# EAGLE design a2600 (EAGLE 7.4.0)
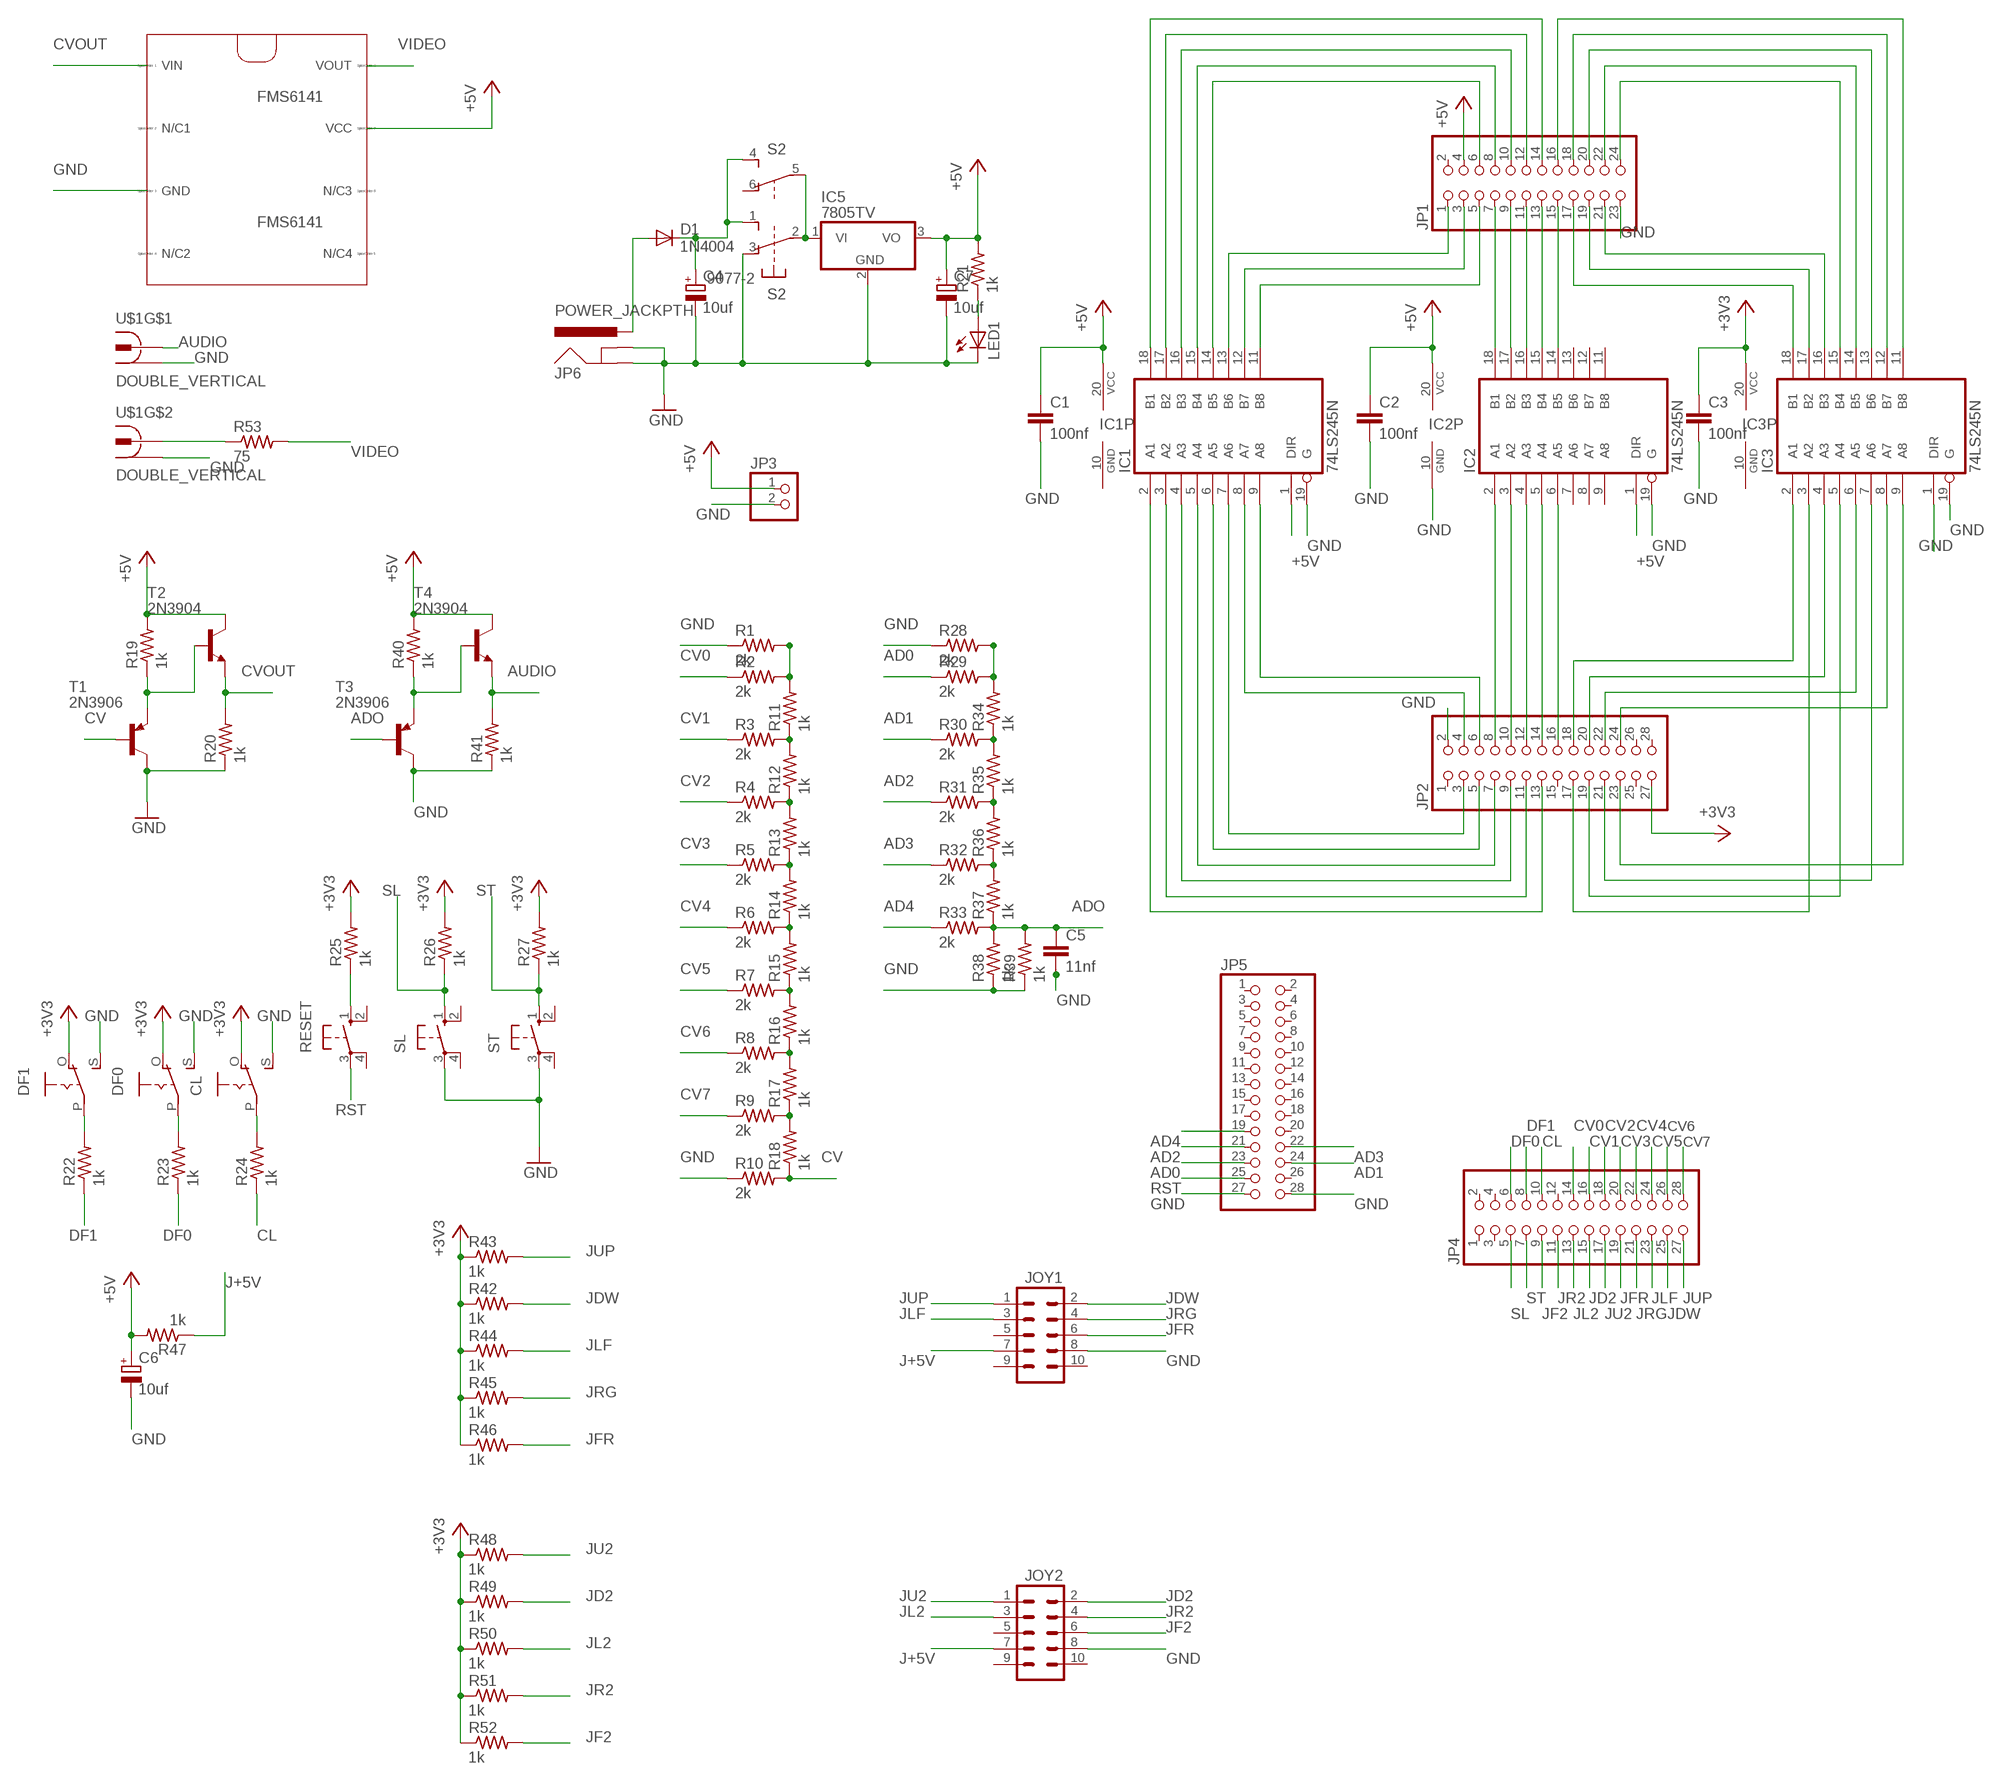
[diagram p0: schematic, sheet 1]

## Parts
C1  100nf  C5/2.5  [C5B2.5]
C2  100nf  C5/2.5  [C5B2.5]
C3  100nf  C5/2.5  [C5B2.5]
C4  10uf  CPOL-EUE2.5-6  [E2,5-6]
C5  11nf  C5/2.5  [C5B2.5]
C6  10uf  CPOL-EUTT2D5L  [TT2D5L]
C7  10uf  CPOL-EUE2.5-6  [E2,5-6]
CL  EG1218S  [EG1218]
D1  1N4004  [DO41-10]
DF0  EG1218S  [EG1218]
DF1  EG1218S  [EG1218]
IC1  74LS245N  [DIL20]
IC2  74LS245N  [DIL20]
IC3  74LS245N  [DIL20]
IC5  7805TV  [TO220V]
JOY1  M05X2SHD_LOCK  [2X5-SHROUDED_LOCK]
JOY2  M05X2SHD_LOCK  [2X5-SHROUDED_LOCK]
JP1  ATARI2600_SLOT  [ATARI2600_SLOT]
JP2  PINHD-2X14  [2X14]
JP3  PINHD-1X2/90  [1X02/90]
JP4  PINHD-2X14  [2X14]
JP5  PINHD-2X14  [2X14]
JP6  POWER_JACKPTH  [POWER_JACK_PTH]
LED1  LED3MM  [LED3MM]
R1  2k  R-US_0309/V  [0309V]
R2  2k  R-US_0309/V  [0309V]
R3  2k  R-US_0309/V  [0309V]
R4  2k  R-US_0309/V  [0309V]
R5  2k  R-US_0309/V  [0309V]
R6  2k  R-US_0309/V  [0309V]
R7  2k  R-US_0309/V  [0309V]
R8  2k  R-US_0309/V  [0309V]
R9  2k  R-US_0309/V  [0309V]
R10  2k  R-US_0309/V  [0309V]
R11  1k  R-US_0309/V  [0309V]
R12  1k  R-US_0309/V  [0309V]
R13  1k  R-US_0309/V  [0309V]
R14  1k  R-US_0309/V  [0309V]
R15  1k  R-US_0309/V  [0309V]
R16  1k  R-US_0309/V  [0309V]
R17  1k  R-US_0309/V  [0309V]
R18  1k  R-US_0309/V  [0309V]
R19  1k  R-US_0309/V  [0309V]
R20  1k  R-US_0309/V  [0309V]
R21  1k  R-US_0309/V  [0309V]
R22  1k  R-US_0309/V  [0309V]
R23  1k  R-US_0309/V  [0309V]
R24  1k  R-US_0309/V  [0309V]
R25  1k  R-US_0309/V  [0309V]
R26  1k  R-US_0309/V  [0309V]
R27  1k  R-US_0309/V  [0309V]
R28  2k  R-US_0309/V  [0309V]
R29  2k  R-US_0309/V  [0309V]
R30  2k  R-US_0309/V  [0309V]
R31  2k  R-US_0309/V  [0309V]
R32  2k  R-US_0309/V  [0309V]
R33  2k  R-US_0309/V  [0309V]
R34  1k  R-US_0309/V  [0309V]
R35  1k  R-US_0309/V  [0309V]
R36  1k  R-US_0309/V  [0309V]
R37  1k  R-US_0309/V  [0309V]
R38  1k  R-US_0309/V  [0309V]
R39  1k  R-US_0309/V  [0309V]
R40  1k  R-US_0309/V  [0309V]
R41  1k  R-US_0309/V  [0309V]
R42  1k  R-US_0309/12  [0309/12]
R43  1k  R-US_0309/12  [0309/12]
R44  1k  R-US_0309/12  [0309/12]
R45  1k  R-US_0309/12  [0309/12]
R46  1k  R-US_0309/12  [0309/12]
R47  1k  R-US_0309/12  [0309/12]
R48  1k  R-US_0309/12  [0309/12]
R49  1k  R-US_0309/12  [0309/12]
R50  1k  R-US_0309/12  [0309/12]
R51  1k  R-US_0309/12  [0309/12]
R52  1k  R-US_0309/12  [0309/12]
R53  75  R-US_0309/V  [0309V]
RESET  10-XX  [B3F-10XX]
S2  9077-2  [9077-2]
SL  10-XX  [B3F-10XX]
ST  10-XX  [B3F-10XX]
T1  2N3906  2N3906-PNP-TO92-EBC  [TO92-EBC]
T2  2N3904  2N3904-NPN-TO92-EBC  [TO92-EBC]
T3  2N3906  2N3906-PNP-TO92-EBC  [TO92-EBC]
T4  2N3904  2N3904-NPN-TO92-EBC  [TO92-EBC]
U$1  DOUBLE_VERTICAL  [DOUBLE-VERTICAL]
X1  FMS6141  [SOIC8]

## Nets
+3V3: C3.1 CL.O DF0.O DF1.O IC3.20(VCC) JP2.27 R25.2 R26.2 R27.2 R42.1 R43.1 R44.1 R45.1 R46.1 R48.1 R49.1 R50.1 R51.1 R52.1
+5V: C1.1 C2.1 C6.+ C7.+ IC1.1(DIR) IC1.20(VCC) IC2.1(DIR) IC2.20(VCC) IC5.3(VO) JP1.4 JP3.1 R19.2 R21.2 R40.2 R47.2 T2.C T4.C X1.6(VCC)
AD0: JP5.23 R29.1
AD1: JP5.24 R30.1
AD2: JP5.21 R31.1
AD3: JP5.22 R32.1
AD4: JP5.19 R33.1
ADO: C5.1 R33.2 R37.1 R38.2 R39.2 T3.B
AUDIO: R41.2 T4.E U$1.HS
CL: JP4.10 R24.1
CV: R10.2 R18.1 T1.B
CV0: JP4.14 R2.1
CV1: JP4.16 R3.1
CV2: JP4.18 R4.1
CV3: JP4.20 R5.1
CV4: JP4.22 R6.1
CV5: JP4.24 R7.1
CV6: JP4.26 R8.1
CV7: JP4.28 R9.1
CVOUT: R20.2 T2.E X1.1(VIN)
DF0: JP4.6 R23.1
DF1: JP4.8 R22.1
GND: C1.2 C2.2 C3.2 C4.- C5.2 C6.- C7.- CL.S DF0.S DF1.S IC1.19(G) IC2.10(GND) IC2.19(G) IC3.1(DIR) IC3.19(G) IC5.2(GND) JOY1.8 JOY2.8 JP1.23 JP2.2 JP3.2 JP5.27 JP5.28 JP6.GND JP6.GNDBREAK LED1.K(C) R1.1 R10.1 R20.1 R28.1 R38.1 R39.1 R41.1 S2.3(1:O) SL.3(P) ST.3(P) T1.C T3.C U$1.HG U$1.LG X1.3(GND)
J+5V: JOY1.7 JOY2.7 R47.1
JD2: JOY2.2 JP4.15 R49.2
JDW: JOY1.2 JP4.25 R42.2
JF2: JOY2.6 JP4.9 R52.2
JFR: JOY1.6 JP4.19 R46.2
JL2: JOY2.3 JP4.13 R50.2
JLF: JOY1.3 JP4.23 R44.2
JR2: JOY2.4 JP4.11 R51.2
JRG: JOY1.4 JP4.21 R45.2
JU2: JOY2.1 JP4.17 R48.2
JUP: JOY1.1 JP4.27 R43.2
N$1: IC1.18(B1) JP1.14
N$2: IC1.17(B2) JP1.12
N$3: IC1.16(B3) JP1.10
N$4: IC1.15(B4) JP1.8
N$5: IC1.14(B5) JP1.6
N$6: IC1.13(B6) JP1.1
N$7: IC1.12(B7) JP1.3
N$8: IC1.11(B8) JP1.5
N$9: IC2.18(B1) JP1.7
N$10: IC2.17(B2) JP1.9
N$11: IC2.16(B3) JP1.11
N$12: IC2.15(B4) JP1.13
N$13: IC2.14(B5) JP1.15
N$14: IC3.18(B1) JP1.17
N$15: IC3.17(B2) JP1.19
N$16: IC3.16(B3) JP1.21
N$17: IC3.15(B4) JP1.24
N$18: IC3.14(B5) JP1.22
N$19: IC3.13(B6) JP1.20
N$20: IC3.12(B7) JP1.18
N$21: IC3.11(B8) JP1.16
N$22: IC1.2(A1) JP2.13
N$23: IC1.3(A2) JP2.11
N$24: IC1.4(A3) JP2.9
N$25: IC1.5(A4) JP2.7
N$26: IC1.6(A5) JP2.5
N$27: IC1.7(A6) JP2.3
N$28: IC1.8(A7) JP2.4
N$29: IC1.9(A8) JP2.6
N$30: IC2.2(A1) JP2.8
N$31: IC2.3(A2) JP2.10
N$32: IC2.4(A3) JP2.12
N$33: IC2.5(A4) JP2.14
N$34: IC2.6(A5) JP2.16
N$35: IC3.2(A1) JP2.18
N$36: IC3.3(A2) JP2.17
N$37: IC3.4(A3) JP2.20
N$38: IC3.5(A4) JP2.19
N$39: IC3.6(A5) JP2.22
N$40: IC3.7(A6) JP2.21
N$41: IC3.8(A7) JP2.24
N$42: IC3.9(A8) JP2.23
N$43: D1.A JP6.PWR
N$44: IC5.1(VI) S2.2(1:P) S2.5(2:P)
N$45: R1.2 R2.2 R11.2
N$46: R3.2 R11.1 R12.2
N$47: R53.1 U$1.LS
N$49: C4.+ D1.C S2.1(1:S) S2.4(2:S)
N$50: R4.2 R12.1 R13.2
N$51: R5.2 R13.1 R14.2
N$52: R6.2 R14.1 R15.2
N$53: R7.2 R15.1 R16.2
N$54: R8.2 R16.1 R17.2
N$55: R9.2 R17.1 R18.2
N$57: R19.1 T1.E T2.B
N$58: LED1.A R21.1
N$59: DF1.P R22.2
N$60: DF0.P R23.2
N$61: CL.P R24.2
N$62: R28.2 R29.2 R34.2
N$63: R30.2 R34.1 R35.2
N$64: R31.2 R35.1 R36.2
N$65: R32.2 R36.1 R37.2
N$66: R25.1 RESET.1(S)
N$67: R40.1 T3.E T4.B
RST: JP5.25 RESET.3(P)
SL: JP4.5 R26.1 SL.1(S)
ST: JP4.7 R27.1 ST.1(S)
VIDEO: R53.2 X1.5(VOUT)
Unconnected: IC2.7(A6) IC2.8(A7) IC2.9(A8) IC2.11(B8) IC2.12(B7) IC2.13(B6) JOY1.5 JOY1.9 JOY1.10 JOY2.5 JOY2.9 JOY2.10 JP1.2 JP2.1 JP2.15 JP2.25 JP2.26 JP2.28 JP4.1 JP4.2 JP4.3 JP4.4 JP4.12 JP5.1 JP5.2 JP5.3 JP5.4 JP5.5 JP5.6 JP5.7 JP5.8 JP5.9 JP5.10 JP5.11 JP5.12 JP5.13 JP5.14 JP5.15 JP5.16 JP5.17 JP5.18 JP5.20 JP5.26 RESET.2(S1) RESET.4(P1) S2.6(2:O) SL.2(S1) SL.4(P1) ST.2(S1) ST.4(P1) X1.2(N/C1) X1.4(N/C2) X1.7(N/C3) X1.8(N/C4)

## Power pins joined to a net without a drawn wire
GND: IC1.10(GND) IC3.10(GND)

## Library data of the parts
C1-C3 C5 = capacitor-wima:C: CAPACITOR naming: grid - package width
C4 C6 C7 = resistor:CPOL-EU: POLARIZED CAPACITOR, European symbol
CL DF0 DF1 = adafruit:EG1218: SLIDING SWITCH 0.1" spacing through hole, vertical SPDT slide switch http://www.ladyada.net/library/pcb/eaglelibrary.html
D1 = adafruit:1N4004: DIODE General purpose 1N400x type rectifier (With bigger pads) http://www.ladyada.net/library/pcb/eaglelibrary.html
IC1-IC3 = 74xx-us:74*245: Octal BUS TRANSCEIVER, 3-state
IC5 = linear:78*: Positive VOLTAGE REGULATOR Source: http://cache.national.com/ds/LM/LM78L05.pdf http://www.fairchildsemi.com/ds/LM/LM7805.pdf
JOY1 JOY2 = SparkFun-Connectors:M05X2: Header 5x2 Standard 10-pin dual row 0.1" header. Commonly used with AVR-ISP. Use with Spark Fun Electronics SKU: PRT-00778
JP1 = atari2600 card edge:ATARI2600_SLOT: Atari 2600 Slot connector Based on Sullins card edge connector 12/24 pin
JP2 JP4 JP5 = pinhead:PINHD-2X14: PIN HEADER
JP3 = pinhead:PINHD-1X2: PIN HEADER
JP6 = SparkFun-Connectors:POWER_JACK: Power Jack This is the standard 5.5mm barrel jack for power. The PTH is the most common, proven, reliable, footprint. The Slot footprint only works if the mill layer is transmitted to the PCB fab house so be warned. Mating wall wart : TOL-00298 (and others); PROD_ID: CONN-08197
LED1 = led:LED: LED OSRAM: - CHIPLED LG R971, LG N971, LY N971, LG Q971, LY Q971, LO R971, LY R971 LH N974, LH R974 LS Q976, LO Q976, LY Q976 LO Q996 - Hyper CHIPLED LW Q18S LB Q993, LB Q99A, LB R99A - SideLED LS A670, LO A670, LY A670, LG A670, LP A670 LB A673, LV A673, LT A673, LW A673 LH A674 LY A675 LS A676, LA A676, LO A676, LY A676, LW A676 LS A679, LY A679, LG A679 - Hyper Micro SIDELED® LS Y876, LA Y876, LO Y876, LY Y876 LT Y87S - SmartLED LW L88C, LW L88S LB L89C, LB L89S, LG L890 LS L89K, LO L89K, LY L89K LS L896, LA L896, LO L896, LY L896 - TOPLED LS T670, LO T670, LY T670, LG T670, LP T670 LSG T670, LSP T670, LSY T670, LOP T670, LYG T670 LG T671, LOG T671, LSG T671 LB T673, LV T673, LT T673, LW T673 LH T674 LS T676, LA T676, LO T676, LY T676, LB T676, LH T676, LSB T676, LW T676 LB T67C, LV T67C, LT T67C, LS T67K, LO T67K, LY T67K, LW E67C LS E67B, LA E67B, LO E67B, LY E67B, LB E67C, LV E67C, LT E67C LW T67C LS T679, LY T679, LG T679 LS T770, LO T770, LY T770, LG T770, LP T770 LB T773, LV T773, LT T773, LW T773 LH T774 LS E675, LA E675, LY E675, LS T675 LS T776, LA T776, LO T776, LY T776, LB T776 LHGB T686 LT T68C, LB T68C - Hyper Mini TOPLED® LB M676 - Mini TOPLED Santana® LG M470 LS M47K, LO M47K, LY M47K Source: http://www.osram.convergy.de LUXEON: - LUMILED® LXK2-PW12-R00, LXK2-PW12-S00, LXK2-PW14-U00, LXK2-PW14-V00 LXK2-PM12-R00, LXK2-PM12-S00, LXK2-PM14-U00 LXK2-PE12-Q00, LXK2-PE12-R00, LXK2-PE12-S00, LXK2-PE14-T00, LXK2-PE14-U00 LXK2-PB12-K00, LXK2-PB12-L00, LXK2-PB12-M00, LXK2-PB14-N00, LXK2-PB14-P00, LXK2-PB14-Q00 LXK2-PR12-L00, LXK2-PR12-M00, LXK2-PR14-Q00, LXK2-PR14-R00 LXK2-PD12-Q00, LXK2-PD12-R00, LXK2-PD12-S00 LXK2-PH12-R00, LXK2-PH12-S00 LXK2-PL12-P00, LXK2-PL12-Q00, LXK2-PL12-R00 Source: www.luxeon.com KINGBRIGHT: KA-3528ASYC Source: www.kingbright.com
R1-R53 = resistor:R-US_: RESISTOR, American symbol
RESET SL ST = switch-omron:10-XX: OMRON SWITCH; MPN: B3F-1000; OC_FARNELL: 176432; OC_NEWARK: 36M3542
S2 = switch-misc:9077-2: MARQUARDT SWITCH 9077.0200 Distributor: Buerklin <https://www.buerklin.com/default.asp?event=ShowArtikel%2812G2822%29&l=d&jump=ArtNr_12G2822>
T1 T3 = transistor-neu-to92:*-PNP-: PNP Transistror
T2 T4 = transistor-neu-to92:*-NPN-: NPN Transistror
U$1 = con-rca-board:DOUBLE_VERTICAL
X1 = Misc:FMS6141: VIDEO FILTER

## Board
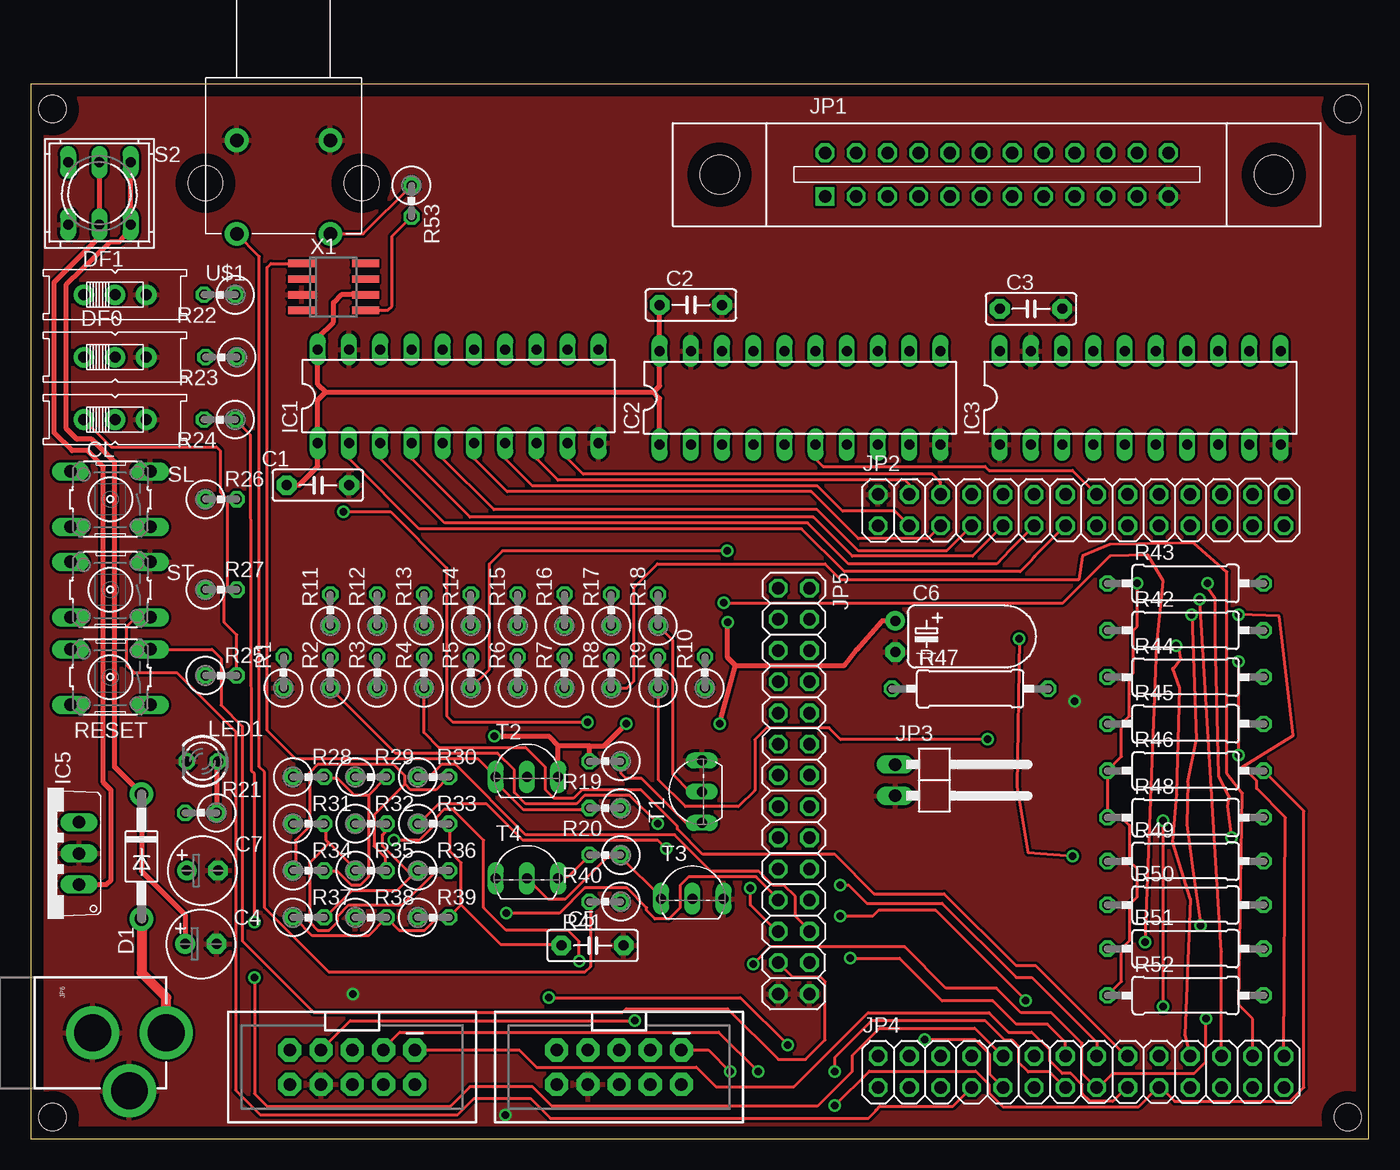
[diagram p1: board, top side]
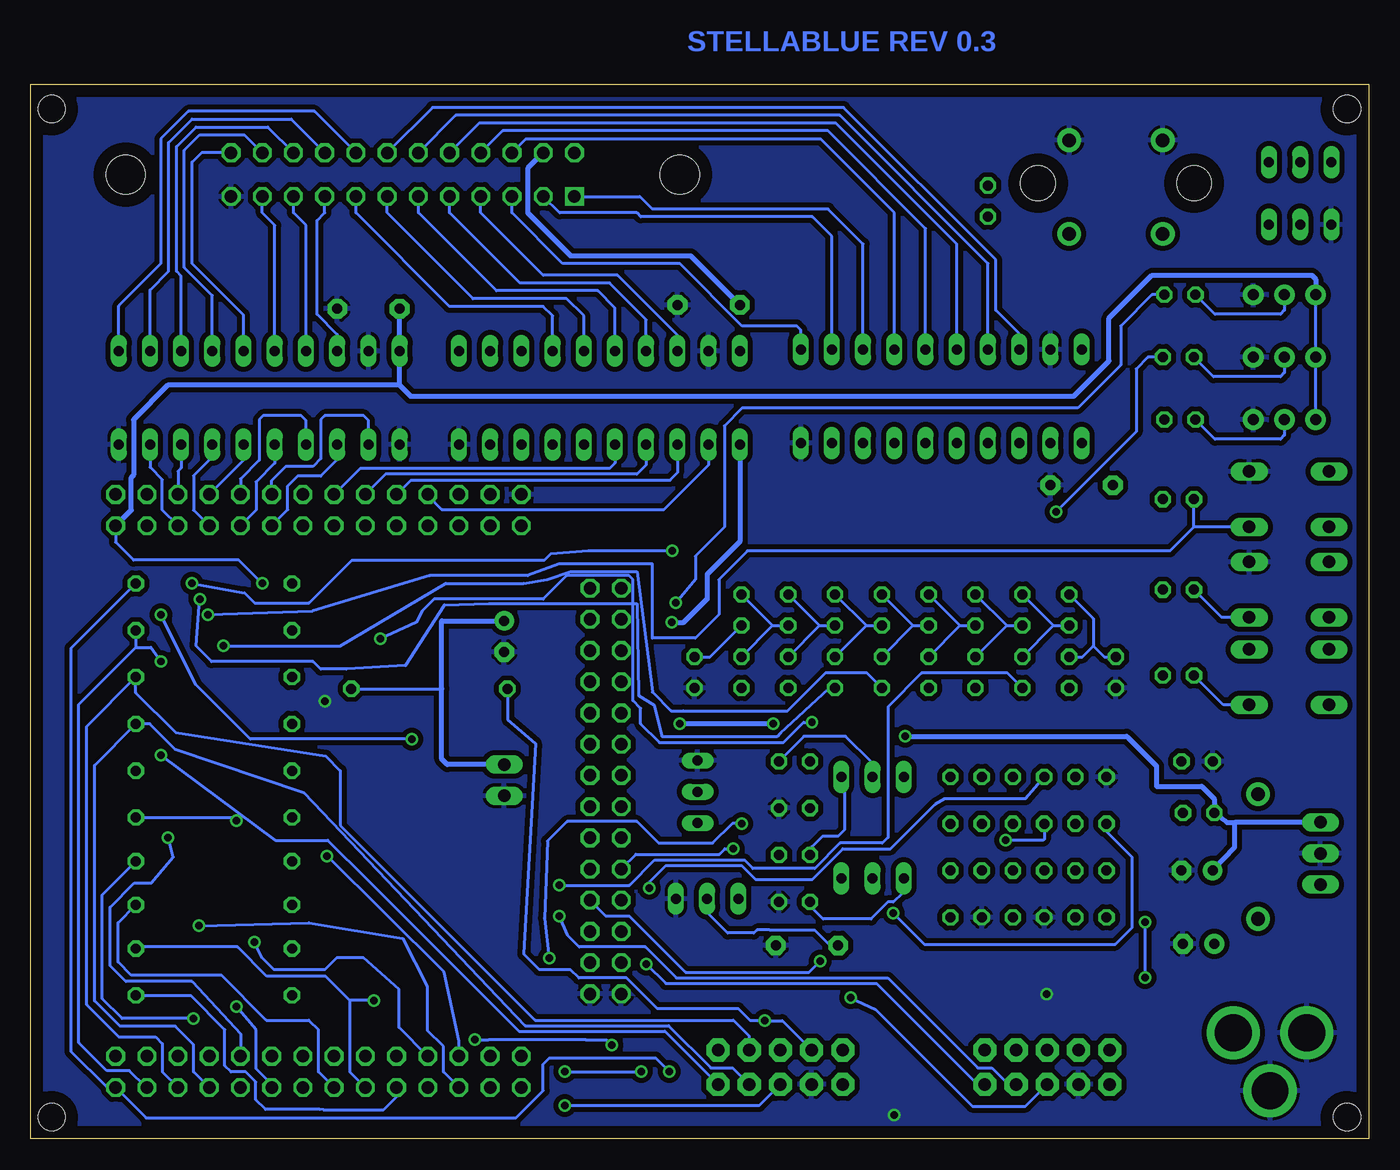
[diagram p2: board, bottom side, seen from below]

Size 108.89 x 85.84 mm. Coordinates in mm from the lower left corner, seen from the top.
Outline: 0,0 108.89,0 108.89,85.84 0,85.84 0,0
Copper layers (1*16): Top 0.035mm / dielectric 1.5mm / Bottom 0.035mm
Design rules "default": minimum track width 10mil, minimum drill 24mil, track to track 8mil, track to pad 8mil, pad to pad 8mil, via to via 8mil, smd to smd 8mil, copper to edge 40mil, drill to drill 8mil, minimum pad ring 10mil, minimum via ring 8mil, stop-mask expansion 4mil, vias tented up to drill 0mil, thermal gap 10mil
Holes 2.2 mm at 1.78,83.82 1.78,1.78 107.19,1.78 107.19,83.82

### Footprints (pad centres in the part's own frame; a part is rotated, then mirrored left to right if it is on the bottom)
C5B2.5 = drill 0.813 pad 1.6 octagon: 1 -2.54,0; 2 2.54,0
E2,5-6 = drill 0.813 pad 1.6: + -1.27,0 | drill 0.813 pad 1.6 octagon: - 1.27,0
TT2D5L = drill 0.813 pad 1.6: + -1.27,0 | drill 0.813 pad 1.6 octagon: - 1.27,0
EG1218 = drill 0.9 pad 1.676: O -2.54,0; P 0,0; S 2.54,0
DO41-10 = drill 1.118 pad 1.93: A 5.08,0; C -5.08,0
DIL20 = drill 0.813 long: 1 -11.43,-3.81; 2 -8.89,-3.81; 3 -6.35,-3.81; 4 -3.81,-3.81; 5 -1.27,-3.81; 6 1.27,-3.81; 7 3.81,-3.81; 8 6.35,-3.81; 9 8.89,-3.81; 10 11.43,-3.81; 11 11.43,3.81; 12 8.89,3.81; 13 6.35,3.81; 14 3.81,3.81; 15 1.27,3.81; 16 -1.27,3.81; 17 -3.81,3.81; 18 -6.35,3.81; 19 -8.89,3.81; 20 -11.43,3.81
TO220V = drill 1.016 long: 1 -2.54,-2.54; 2 0,-2.54; 3 2.54,-2.54
2X5-SHROUDED_LOCK = drill 1.016 pad 1.88 octagon: 1 -1.397,5.08; 2 1.397,5.08; 3 -1.397,2.54; 4 1.397,2.54; 5 -1.397,0; 6 1.397,0; 7 -1.397,-2.54; 8 1.397,-2.54; 9 -1.397,-5.08; 10 1.397,-5.08
ATARI2600_SLOT = drill 1.016 square: 1 -13.97,-1.778 | drill 1.016 octagon: 2 -13.97,1.778; 3 -11.43,-1.778; 4 -11.43,1.778; 5 -8.89,-1.778; 6 -8.89,1.778; 7 -6.35,-1.778; 8 -6.35,1.778; 9 -3.81,-1.778; 10 -3.81,1.778; 11 -1.27,-1.778; 12 -1.27,1.778; 13 1.27,-1.778; 14 1.27,1.778; 15 3.81,-1.778; 16 3.81,1.778; 17 6.35,-1.778; 18 6.35,1.778; 19 8.89,-1.778; 20 8.89,1.778; 21 11.43,-1.778; 22 11.43,1.778; 23 13.97,-1.778; 24 13.97,1.778 | hole 3.175: -22.543,0; 22.543,0
2X14 = drill 1.016 octagon: 1 -16.51,-1.27; 2 -16.51,1.27; 3 -13.97,-1.27; 4 -13.97,1.27; 5 -11.43,-1.27; 6 -11.43,1.27; 7 -8.89,-1.27; 8 -8.89,1.27; 9 -6.35,-1.27; 10 -6.35,1.27; 11 -3.81,-1.27; 12 -3.81,1.27; 13 -1.27,-1.27; 14 -1.27,1.27; 15 1.27,-1.27; 16 1.27,1.27; 17 3.81,-1.27; 18 3.81,1.27; 19 6.35,-1.27; 20 6.35,1.27; 21 8.89,-1.27; 22 8.89,1.27; 23 11.43,-1.27; 24 11.43,1.27; 25 13.97,-1.27; 26 13.97,1.27; 27 16.51,-1.27; 28 16.51,1.27
1X02/90 = drill 1.016 long: 1 -1.27,-3.81; 2 1.27,-3.81
POWER_JACK_PTH = drill 2.997 pad 4.318: GND 0,7.7; GNDBREAK 4.7,10.7; PWR 0,13.7
LED3MM = drill 0.813 octagon: A -1.27,0; K 1.27,0
0309V = drill 0.813 octagon: 1 -1.27,0; 2 1.27,0
0309/12 = drill 0.813 octagon: 1 -6.35,0; 2 6.35,0
B3F-10XX = drill 1.016 long: 1 -3.251,2.261; 2 3.251,2.261; 3 -3.251,-2.261; 4 3.251,-2.261
9077-2 = drill 0.813 long: 1 -2.54,2.54; 2 0,2.54; 3 2.54,2.54; 4 -2.54,-2.54; 5 0,-2.54; 6 2.54,-2.54
TO92-EBC = drill 0.813 long: B 0,-1.27; C 2.54,-1.27; E -2.54,-1.27
DOUBLE-VERTICAL = drill 1.1 pad 1.93: HG -3.81,3.81; HS -3.81,-3.81; LG 3.81,3.81; LS 3.81,-3.81 | hole 2.8: -6.35,0.318; 6.35,0.318
SOIC8 = smd 0.6 x 2.2: 1 -1.905,-2.6; 2 -0.635,-2.6; 3 0.635,-2.6; 4 1.905,-2.6; 5 1.905,2.6; 6 0.635,2.6; 7 -0.635,2.6; 8 -1.905,2.6

### Placement (x,y rotation side)
C1  23.37,53.21 0 top
C2  53.72,67.88 0 top
C3  81.41,67.56 0 top
C4  13.84,15.88 0 top
C5  45.72,15.75 0 top
C6  70.36,40.89 270 top
C7  13.97,21.84 0 top
CL  6.86,58.55 0 top
D1  9.02,22.99 270 top
DF0  6.86,63.63 0 top
DF1  6.86,68.71 0 top
IC1  34.8,60.45 0 top
IC2  62.61,60.33 0 top
IC3  90.3,60.33 0 top
IC5  1.4,23.24 90 top
JOY1  47.88,5.84 270 top
JOY2  26.16,5.84 270 top
JP1  78.61,78.49 0 top
JP2  85.47,51.18 0 top
JP3  74.17,29.21 270 top
JP4  85.47,5.46 0 top
JP5  62.1,28.32 270 top
JP6  -2.67,8.64 270 top
LED1  13.97,30.73 180 top
R1  20.57,37.97 90 top
R2  24.38,37.97 90 top
R3  28.19,37.97 90 top
R4  32,37.97 90 top
R5  35.81,37.97 90 top
R6  39.62,37.97 90 top
R7  43.43,37.97 90 top
R8  47.24,37.97 90 top
R9  51.05,37.97 90 top
R10  54.86,37.97 90 top
R11  24.38,43.05 90 top
R12  28.19,43.05 90 top
R13  32,43.05 90 top
R14  35.81,43.05 90 top
R15  39.62,43.05 90 top
R16  43.43,43.05 90 top
R17  47.24,43.05 90 top
R18  51.05,43.05 90 top
R19  46.74,30.73 180 top
R20  46.74,26.92 180 top
R21  13.84,26.54 180 top
R22  15.37,68.71 180 top
R23  15.49,63.63 180 top
R24  15.37,58.55 180 top
R25  15.49,37.72 0 top
R26  15.49,52.07 0 top
R27  15.49,44.7 0 top
R28  22.61,29.46 0 top
R29  27.69,29.46 0 top
R30  32.77,29.46 0 top
R31  22.61,25.65 0 top
R32  27.69,25.65 0 top
R33  32.77,25.65 0 top
R34  22.61,21.84 0 top
R35  27.69,21.84 0 top
R36  32.77,21.84 0 top
R37  22.61,18.03 0 top
R38  27.69,18.03 0 top
R39  32.77,18.03 0 top
R40  46.74,23.11 180 top
R41  46.74,19.3 180 top
R42  93.98,41.4 0 top
R43  93.98,45.21 0 top
R44  93.98,37.59 0 top
R45  93.98,33.78 0 top
R46  93.98,29.97 0 top
R47  76.45,36.64 0 top
R48  93.98,26.16 0 top
R49  93.98,22.61 0 top
R50  93.98,19.05 0 top
R51  93.98,15.49 0 top
R52  93.98,11.68 0 top
R53  30.99,76.33 270 top
RESET  6.48,37.59 180 top
S2  5.59,76.96 180 top
SL  6.48,52.07 180 top
ST  6.48,44.7 180 top
T1  53.34,28.26 90 top
T2  40.39,30.73 0 top
T3  53.85,20.83 0 top
T4  40.39,22.48 0 top
U$1  20.57,77.47 0 top
X1  24.64,69.34 270 top

### Tracks (layer width: path | path; a pad name or v marks a point on that pad's centre or on a via)
+3V3  (via drill 0.61)
  Top 0.254: CL.O 6.54,56.32 15.11,56.32 15.43,56.01 15.43,52.64 16,52.07 | 88.77,33.78 88.77,31.12 R46.1 R48.1 88.77,26.16 89.41,25.53 89.41,22.61 | 88.77,33.78 89.41,34.42 89.41,37.59 | 89.41,37.59 89.73,37.91 89.73,41.4 | 89.73,41.4 90.04,41.72 v90.04,45.21 R43.1 | R44.1 89.41,37.59 | R45.1 88.77,33.78 | R52.1 88.77,12.83 88.77,15.49 | 88.77,15.49 R51.1 | 89.41,19.05 89.41,16.13 88.77,15.49 | 89.41,22.61 R49.1 | 89.41,19.05 90.04,19.68 90.04,21.97 89.41,22.61 | R50.1 89.41,19.05 | 16,52.07 16,44.7 | 16,44.7 R27.2 | R26.2 16,52.07 | 16,44.7 15.75,44.45 15.75,42.04 16.76,41.02 R25.2 | 89.73,41.4 R42.1
  Bottom 0.254: v90.04,45.21 91.95,47.12 100.52,47.12 101.98,48.58 JP2.27 | CL.O DF0.O DF1.O
  Bottom 0.406: JP2.27 100.71,51.18 100.71,53.85 100.52,54.04 100.52,58.55 97.73,61.34 78.87,61.34 | C3.1 IC3.20 78.87,61.34 | 78.87,61.34 77.98,60.45 24,60.45 21.14,63.31 21.14,66.8 17.65,70.29 4.64,70.29 4.32,69.98 DF1.O
+5V  (via drill 0.61)
  Top 0.254: T4.C 43.03,21.34 43.71,21.34 45.31,22.94 R40.2
  Top 0.406: v37.72,32.77 42.16,32.77 42.93,32 | T2.C 42.93,32 | R19.2 45.47,32 | 45.47,32 42.93,32 | 45.47,32 46.67,32 v48.45,33.78 | v56.07,33.78 57.34,38.54 | 57.34,38.54 66.23,38.54 67.18,39.81 69.28,42.16 C6.+ | C1.1 21.84,53.21 23.37,54.74 IC1.1 23.37,60.13 24,60.77 | 24,60.77 50.67,60.77 | 50.67,60.77 51.18,61.28 IC2.20 C2.1 | IC2.1 51.18,60.26 50.67,60.77 | 24,60.77 23.37,61.4 IC1.20 23.37,65.22 24.64,66.48 24.64,68.07 25.27,68.71 X1.6 | 57.34,38.54 56.71,39.18 v56.71,42.04
  Bottom 0.254: R40.2 45.31,23.16 45.31,23.77 44.45,24.64 43.18,24.64 42.67,25.15 42.67,29.21 T2.C | R47.2 75.44,36.64
  Bottom 0.406: 10.92,25.76 4.06,25.76 IC5.3 | v37.72,32.77 19.71,32.77 19.56,32.64 17.27,30.35 17.27,28.7 13.59,28.7 12.57,27.69 R21.2 11.53,25.76 10.92,25.76 | C7.+ 10.92,23.75 10.92,25.76 | v48.45,33.78 v56.07,33.78 | JP3.1 74.99,30.48 75.44,30.93 75.44,36.64 75.44,42.16 C6.+ | IC2.1 51.18,48.62 53.85,45.95 53.85,43.94 55.75,42.04 v56.71,42.04 | JP1.4 68.45,78.99 68.45,75.37 64.96,71.88 55.18,71.88 C2.1
AD0  (via drill 0.61)
  Top 0.254: v58.57,20.42 58.57,19.05 60.63,16.99 JP5.23
  Bottom 0.254: v58.57,20.42 58.57,20.88 57.2,22.25 51.03,22.25 49.89,21.11 45.31,21.11 42.8,23.62 38.91,23.62 35.31,27.23 34.54,27.69 27.94,27.69 R29.1
AD1
  Top 0.254: R30.1 31.6,29.57 32.51,29.57 33.43,30.48 34.57,30.48 40.28,24.77 52.4,24.77 55.37,21.79 59.26,21.79 60.4,20.65 61.32,20.65 62.23,19.74 62.23,18.14 63.37,16.99 JP5.24
AD2  (via drill 0.61)
  Top 0.254: v38.68,18.36 43.03,18.36 45.09,20.42 48.51,20.42 50.11,18.82 50.11,18.59 50.8,17.91 51.94,17.91 52.86,18.82 52.86,20.65 53.54,21.34 59.03,21.34 60.86,19.51 JP5.21
  Bottom 0.254: v38.68,18.36 36.17,15.85 20.62,15.85 19.25,17.22 19.25,22.94 21.31,24.99 21.31,25.45 R31.1
AD3  (via drill 0.61)
  Top 0.254: v29.54,24.31 31.6,24.31 32.97,25.68 32.97,26.14 33.66,26.82 34.34,26.82 36.86,24.31 36.86,18.82 38.68,16.99 43.71,16.99 44.63,16.08 v44.63,14.48
  Bottom 0.254: v44.63,14.48 45.54,13.56 55.6,13.56 60.17,18.14 62.08,18.14 JP5.22 | R32.1 26.42,24.38 26.49,24.31 v29.54,24.31
AD4  (via drill 0.61)
  Top 0.254: v51.71,23.62 51.03,24.31 40.06,24.31 37.08,27.28 33.2,27.28 31.6,25.68 R33.1
  Bottom 0.254: v51.71,23.62 52.4,23.62 52.86,23.16 59.64,23.16 JP5.19
ADO
  Top 0.254: R37.1 21.54,17.91 22.91,16.54 27.48,16.54 28.85,17.91 R38.2 30,16.99 32.05,16.99 32.97,17.91 33.88,17.91 R39.2 34.11,18.14 35.03,19.05 | 35.03,19.05 35.03,22.48 34.11,23.39 34.11,25.45 R33.2 | 35.03,19.05 38.23,15.85 43.03,15.85 C5.1
  Bottom 0.254: T3.B 53.77,19.51 53.77,18.36 52.17,16.76 50.04,16.76 49.78,17.02 48.77,17.02 48.74,16.99 45.09,16.99 43.94,15.85 43.26,15.85 C5.1
AUDIO
  Top 0.254: R41.2 45.54,19.28 45.54,14.02 45.09,13.56 24.28,13.56 19.02,18.82 19.02,29.87 18.61,30.29 18.61,71.82 U$1.HS
  Bottom 0.254: R41.2 45.31,19.28 45.31,18.82 44.4,17.91 40.51,17.91 39.14,19.28 38.68,19.28 38,19.96 38,21.11 T4.E
CL  (via drill 0.61)
  Top 0.254: v18.21,17.67 18.21,29.73 17.97,29.97 17.89,57.29 R24.1 | v18.21,13.14 18.21,3.7 19.24,2.67 34.16,2.67 35.75,4.25 40.83,4.25 42.42,2.67 64.01,2.67 66.87,5.53 66.87,6.79 69.09,9.02 76.83,9.02 JP4.10
  Bottom 0.254: v18.21,17.67 v18.21,13.14
CV
  Top 0.254: T1.B 53.66,28.26 52.26,29.65 52.26,40.58 R18.1
  Bottom 0.254: R10.2 53.59,39.24 R18.1
CV0  (via drill 0.61)
  Top 0.254: v51.03,25.68 48.74,27.96 45.09,27.96 44.4,27.28 40.28,27.28 39.37,28.19 39.37,30.02 38,31.39 29.69,31.39 R2.1 | JP4.14 84.2,7.87 82.74,9.33 80.2,9.33 78.3,11.24 74.17,11.24 70.7,14.71 v66.7,14.71
  Bottom 0.254: v51.03,25.68 51.79,25.68 53.39,24.08 57.8,24.08 59.56,25.84 65.24,25.84 66.84,24.24 67.09,17.96 v66.7,14.71
CV1  (via drill 0.61)
  Top 0.254: v65.88,20.65 66.57,20.65 68.05,19.18 74.17,19.18 80.2,13.14 81.47,13.14 86.74,7.87 JP4.16
  Bottom 0.254: v65.88,20.65 60.17,20.65 58.12,22.71 50.8,22.71 50.11,22.02 45.09,22.02 43.03,24.08 39.6,24.08 39.14,24.54 39.12,24.54 39.12,35.18 36.39,37.91 29.4,37.91 R3.1
CV2
  Top 0.254: JP4.18 89.15,6.73 81.79,14.1 80.2,14.1 74.33,19.96 68.63,19.96 65.43,23.16 54.69,23.16 52.63,25.22 52.63,25.45 49.66,28.42 44.86,28.42 44.17,27.74 42.57,27.74 41.89,28.42 41.89,30.25 40.26,31.88 33.21,31.88 32,33.08 R4.1
CV3  (via drill 0.61)
  Top 0.254: v56.68,47.85 38.39,47.85 37.34,46.8 37.34,38.23 R5.1 | v95.76,45.21 96.05,45.39 95.76,44.9 96.39,43.94 96.39,40.92 96.7,29.5 97.51,27.91 97.4,27.08 v97.71,24.54
  Bottom 0.254: v95.76,45.21 91.49,44.44 90.68,43.62 86.23,43.62 82.74,47.12 67.09,47.12 66.59,47.62 63.5,47.85 v56.68,47.85 | v97.71,24.54 97.28,22.95 99.08,20.83 100.46,20.83 102.43,18.86 102.43,14.1 101.16,12.83 95.76,12.83 91.82,8.57 JP4.20
CV4  (via drill 0.61)
  Top 0.254: v93.22,40.13 93.42,40.07 93.6,39.12 92.93,38.2 92.93,38.3 93.5,36.72 93.28,28.04 92.96,24.14 94.37,19.56 93.92,8.45 JP4.22
  Bottom 0.254: v93.22,40.13 83.69,40.13 75.12,45.21 68.77,45.21 66.87,45.53 64.96,46.16 59.56,46.16 58.29,36.37 56.77,34.85 55.8,34.85 47.32,34.82 44.23,37.91 40.83,37.91 R6.1
CV5  (via drill 0.61)
  Top 0.254: JP4.24 96.9,15.24 v95.12,43.94
  Bottom 0.254: R7.1 43.48,36.65 43.94,36.65 47.87,33.05 47.87,33.03 48.13,32.77 57.52,32.77 58.15,35.31 59.42,36.08 59.56,43.56 71.63,43.56 75.22,43.46 78.4,38.52 83.19,38.24 85.29,38.24 85.91,38.86 94.17,38.86 95.44,40.13 v95.12,43.94
CV6
  Top 0.254: R8.1 48.51,36.7 49.09,37.27 49.09,44.9 50.99,46.8 64.64,46.8 65.91,45.53 85.28,45.53 85.6,47.43 87.82,48.39 94.65,48.52 97.35,46.15 97.35,29.73 98.62,28.14 98.3,10.92 99.44,9.78 JP4.26
CV7  (via drill 0.61)
  Top 0.254: v98.3,42.67 101.6,42.55 102.74,32.83 98.62,30.29 99.76,29.15 99.76,28.51 102.11,26.16 JP4.28 | R9.1 51.05,29.27 53.28,27.05 57.6,27.05 58.93,28.38 58.93,32.51 59.88,33.47 64.96,33.47 65.91,32.51 77.84,32.51 v77.86,32.54
  Bottom 0.254: v77.86,32.54 91.02,32.54 95.44,36.96 v98.3,42.67
CVOUT
  Top 0.254: R20.2 45.31,26.82 40.06,26.82 38,28.88 38,29.34 T2.E 37.77,29.57 36.4,30.94 21.56,30.94 19.24,33.26 19.24,70.93 19.56,71.25 X1.1
DF0  (via drill 0.61)
  Top 0.254: v45.31,33.91 34.35,33.91 33.85,34.42 33.85,46.48 29.27,51.05 v25.43,51.05 | v80.44,40.7 80.26,28.64 81.15,23.3 v84.78,23.03
  Bottom 0.254: v45.31,33.91 46,33.91 47.64,32.27 57.73,32.27 59.25,33.78 59.25,35.05 59.88,35.69 59.88,45.53 60.2,45.85 65.28,45.85 67.18,43.94 76.07,43.94 77.02,42.99 77.52,42.04 v80.44,40.7 | v84.78,23.03 75.26,13.61 74.04,7.95 JP4.6 | R23.1 17.97,63.63 18.92,62.67 18.92,57.56 v25.43,51.05
DF1  (via drill 0.61)
  Top 0.254: v90.7,16.03 91.66,40.2 92.16,45.4 90.89,47.54 87.82,47.43 84.01,43.62 v56.39,43.62
  Bottom 0.254: R22.1 17.65,68.71 20.19,66.17 20.19,62.99 23.68,59.5 50.99,59.5 52.45,58.04 52.45,49.78 54.8,47.43 54.8,45.53 v56.39,43.62 | JP4.8 78.93,9.08 78.93,12.19 81.81,14.76 83.98,14.76 84.96,13.78 89.09,13.78 90.04,14.73 v90.7,16.03
GND  (via drill 0.61)
  Top 0.254: 63.37,11.74 JP5.28 | 48.06,19.28 R41.1
  other vias: 38.61,1.97 26.23,11.81 84.96,35.62
  pour Bottom (isolate 0.406): 0,86.49 108.97,86.49 108.97,0 0,0
  pour Top: 0,86.49 108.97,86.49 108.97,0 0,0
J+5V  (via drill 0.61)
  Top 0.254: JOY2.7 26.01,9.63 v49.15,9.63
  Bottom 0.254: JOY1.7 47.73,9.63 v49.15,9.63 50.33,9.63 51.31,10.6 57.9,10.6 60.4,13.11 64.29,13.11 64.96,13.78 67.5,13.78 68.77,15.05 67.82,32.2 70.04,34.1 70.04,36.58 R47.1
JD2  (via drill 0.61)
  Top 0.254: v58.8,14.25 60.17,15.62 71.13,15.62 74.49,12.27 78.6,12.27 80.58,10.29 83.06,10.29 85.55,7.8 85.55,5.33 86.69,4.19 JP4.15 86.92,4.19 88.06,5.33 94.69,5.33 95.63,6.27 v95.63,9.8
  Bottom 0.254: v58.8,14.25 57.2,12.65 40.06,12.65 32.05,4.65 31.37,4.65 JOY2.2 | v95.63,9.8 101.45,9.8 103.06,11.42 103.06,19.88 R49.2
JDW  (via drill 0.61)
  Top 0.254: v98.3,31.24 v98.3,38.86
  Bottom 0.254: JP4.25 99.49,4.19 100.86,5.56 102.69,5.56 104.96,7.84 104.96,35.37 100.33,40.01 | v98.3,31.24 88.98,24.31 84.71,24.31 81.47,21.08 69.15,8.76 57.28,8.76 JOY1.2 | R42.2 100.33,40.01 | v98.3,38.86 99.12,40.01 100.33,40.01
JF2  (via drill 0.61)
  Top 0.254: v72.76,8.08 76.86,8.08 78,6.93 78,5.31 JP4.9 | v42.16,11.49 57.76,11.49 v61.61,7.64
  Bottom 0.254: v72.76,8.08 71.61,8.08 63.7,8.05 62.01,8.05 v61.61,7.64 | JP4.9 79.12,3.43 80.16,2.39 85.09,2.39 85.37,2.41 89.79,2.41 90.58,3.2 90.58,4.65 91.39,5.46 92.58,5.46 93.09,5.97 93.09,8.89 95.88,11.68 R52.2 | v42.16,11.49 40.13,10.54 32.26,2.67 27.94,2.67 JOY2.6
JFR  (via drill 0.61)
  Top 0.254: v65.44,2.73 68.24,5.53 76.9,5.53 78,4.42 78,3.73 79.15,2.59 90.12,2.59 91.72,4.19 JP4.19 91.95,4.19 93.09,3.05 102.46,3.05 103.61,4.19 103.61,26.7 R46.2
  Bottom 0.254: v65.44,2.73 49.59,2.73 JOY1.6
JL2  (via drill 0.61)
  Top 0.254: JP4.13 84.18,4.19 82.91,5.46 81.18,5.46 80.39,6.25 80.39,7.56 79.88,8.06 79.25,8.06 77.66,9.65 68.45,9.65 65.44,6.64 v65.44,5.47 | JOY2.3 28.7,7.37 30.04,8.7 55.98,8.7 v59.21,5.47
  Bottom 0.254: v65.44,5.47 v59.21,5.47 | JP4.13 85.47,5.46 85.47,8.89 86.26,9.68 89.71,9.68 93.37,13.34 100.71,13.34 101.79,14.41 101.79,17.59 R50.2
JLF
  Bottom 0.254: JP4.23 98.17,5.46 98.17,7.75 98.73,8.31 101.71,8.31 104.33,10.92 104.33,33.59 R44.2 100.33,36.31 97.09,33.07 84.89,31.17 83.69,29.97 83.69,25.53 67.84,9.68 51.71,9.68 50.42,8.38 JOY1.3
JR2  (via drill 0.61)
  Top 0.254: v65.88,18.14 68.52,18.14 68.97,18.59 73.66,18.59 v80.97,11.28
  Bottom 0.254: JOY2.4 28.85,4.65 29.54,4.65 30.68,5.79 31.83,5.79 39.14,13.11 56.35,13.11 58.86,15.62 64.26,15.62 65.24,16.6 v65.88,18.14 | JP4.11 82.93,5.46 82.93,11.28 | v80.97,11.28 82.93,11.28 | 82.93,11.28 84.9,13.25 89.69,13.25 92.06,15.62 100.2,15.62 R51.2
JRG
  Bottom 0.254: JP4.21 95.63,5.46 95.63,7.68 97.12,9.17 101.62,9.17 103.7,11.24 103.7,30.42 R45.2 99.2,33.78 97.16,31.74 86.68,28.19 68.66,9.22 56.97,9.22 53.54,5.79 51.77,5.79 JOY1.4
JU2  (via drill 0.61)
  Top 0.254: JP4.17 89.2,4.19 88.06,3.05 86.23,3.05 85.55,3.73 85.55,4.42 84.63,5.33 83.95,5.33 82.93,6.35 82.93,7.24 81.47,8.7 79.57,8.7 77.98,10.29 68.13,10.29 62.1,4.25 55.75,4.25 54.16,5.84 41.15,5.84 39.75,7.24 JOY2.1 | v92.16,10.79 v92.16,25.91
  Bottom 0.254: JP4.17 89.28,4.45 90.55,5.71 90.55,8.87 v92.16,10.79 | R48.2 92.42,26.16 v92.16,25.91
JUP  (via drill 0.61)
  Top 0.254: JOY1.1 55.14,7.24 v56.91,5.47
  Bottom 0.254: R43.2 105.6,39.94 105.6,7.11 102.68,4.19 JP4.27 99.5,1.71 69.41,1.71 67.18,3.94 67.18,6.1 66.67,6.6 58.04,6.6 v56.91,5.47
N$1
  Bottom 0.254: IC1.18 28.45,65.53 30.35,67.44 30.35,71.56 42.73,83.95 76.2,83.95 JP1.14
N$2
  Bottom 0.254: IC1.17 30.99,71.25 43.05,83.31 74.3,83.31 JP1.12
N$3
  Bottom 0.254: IC1.16 33.53,72.83 43.37,82.68 72.39,82.68 JP1.10
N$4
  Bottom 0.254: IC1.15 36.07,74.11 44.01,82.04 70.48,82.04 JP1.8
N$5
  Bottom 0.254: JP1.6 68.58,81.41 44.64,81.41 38.61,75.37 IC1.14
N$6
  Bottom 0.254: JP1.1 59.31,76.71 58.29,75.69 44.01,75.69 41.15,72.83 IC1.13
N$7
  Bottom 0.254: IC1.12 43.69,73.47 45.28,75.06 59.25,75.06 59.56,75.37 65.85,75.37 JP1.3
N$8
  Bottom 0.254: IC1.11 46.23,65.85 46.55,66.17 50.99,66.17 56.07,71.25 65.6,71.25 69.72,75.37 JP1.5
N$9
  Bottom 0.254: IC2.18 56.26,65.41 61.15,70.29 67.18,70.29 72.26,75.37 JP1.7
N$10
  Bottom 0.254: IC2.17 58.8,66.67 61.79,69.66 69.09,69.66 74.8,75.37 JP1.9
N$11
  Bottom 0.254: IC2.16 61.34,67.63 62.74,69.03 70.99,69.03 77.34,75.37 JP1.11
N$12
  Bottom 0.254: IC2.15 63.88,66.99 65.28,68.39 72.9,68.39 79.88,75.37 JP1.13
N$13
  Bottom 0.254: IC2.14 66.42,66.99 67.18,67.75 74.8,67.75 82.42,75.37 JP1.15
N$14
  Bottom 0.254: IC3.18 83.95,65.47 85.6,67.12 85.6,74.74 84.96,75.37 JP1.17
N$15
  Bottom 0.254: IC3.17 86.49,74.36 87.5,75.37 JP1.19
N$16
  Bottom 0.254: IC3.16 89.03,74.36 90.04,75.37 JP1.21
N$17
  Bottom 0.254: IC3.15 91.57,67.06 95.76,71.25 95.76,79.5 95,80.26 JP1.24
N$18
  Bottom 0.254: IC3.14 94.11,68.64 96.39,70.93 96.39,80.45 95.12,81.72 91.5,81.72 JP1.22
N$19
  Bottom 0.254: IC3.13 96.65,70.23 97.03,70.61 97.03,80.77 95.44,82.36 89.6,82.36 JP1.20
N$20
  Bottom 0.254: IC3.12 99.19,69.09 97.66,70.61 97.66,81.09 95.76,83 87.69,83 JP1.18
N$21
  Bottom 0.254: JP1.16 85.79,83.63 96.07,83.63 98.3,81.41 98.3,71.25 101.73,67.82 IC3.11
N$22
  Top 0.254: JP2.13 81.72,47.43 81.47,47.12 80.52,46.16 66.23,46.16 62.74,49.66 31.62,49.66 25.91,55.37 IC1.2
N$23
  Top 0.254: JP2.11 79.66,47.91 78.61,46.8 66.55,46.8 63.21,50.13 33.69,50.13 28.45,55.37 IC1.3
N$24
  Top 0.254: JP2.9 76.64,47.43 66.87,47.43 63.69,50.61 35.75,50.61 30.99,55.37 IC1.4
N$25
  Top 0.254: JP2.7 74.52,47.85 67.36,47.85 64,51.21 37.69,51.21 33.53,55.37 IC1.5
N$26
  Top 0.254: JP2.5 72.99,48.86 67.34,48.86 63.53,52.67 38.77,52.67 36.07,55.37 IC1.6
N$27
  Top 0.254: JP2.3 70.33,51.09 66.07,51.09 64.01,53.15 40.83,53.15 38.61,55.37 IC1.7
N$28
  Top 0.254: JP2.4 71.5,53.28 71.15,53.63 42.89,53.63 41.15,55.37 IC1.8
N$29
  Top 0.254: IC1.9 43.69,55.37 44.96,54.1 73.37,54.1 74.04,53.44 JP2.6
N$30
  Bottom 0.254: JP2.8 76.58,52.39 75.44,51.24 57.34,51.24 53.72,54.86 IC2.2
N$31
  Bottom 0.254: JP2.10 77.95,53.63 56.86,53.63 56.26,54.23 IC2.3
N$32
  Bottom 0.254: IC2.4 58.8,54.86 59.56,54.1 80.01,54.1 JP2.12
N$33
  Bottom 0.254: IC2.5 61.34,55.02 61.79,54.58 82.07,54.58 JP2.14
N$34
  Top 0.254: IC2.6 63.88,55.34 64.48,54.74 77.66,54.74 77.98,54.42 84.77,54.42 JP2.16
N$35
  Bottom 0.254: IC3.2 81.41,58.48 81.79,58.86 84.96,58.86 85.28,58.55 85.28,55.37 85.91,54.74 88.14,54.74 89.28,53.59 JP2.18
N$36
  Bottom 0.254: IC3.3 83.95,55.28 85.28,53.94 87.19,53.94 87.98,53.15 87.98,51.21 JP2.17
N$37
  Bottom 0.254: IC3.4 86.49,58.48 86.87,58.86 89.98,58.86 90.3,58.55 90.3,55.24 91.82,53.72 JP2.20
N$38
  Bottom 0.254: IC3.5 89.03,54.99 90.55,53.47 90.55,51.18 JP2.19
N$39
  Bottom 0.254: IC3.6 91.57,55.24 JP2.22
N$40
  Bottom 0.254: IC3.7 94.11,55.5 95.63,53.98 95.63,51.18 JP2.21
N$41
  Bottom 0.254: IC3.8 96.65,54.61 96.9,54.36 JP2.24
N$42
  Bottom 0.254: JP2.23 98.17,51.18 98.17,53.66 99.19,54.67 IC3.9
N$43
  Top 0.813: D1.A 9.02,13.53 11.03,11.51 JP6.PWR
N$44
  Top 0.406: S2.5 S2.2 5.59,73.41 1.91,69.72 1.91,57.47 3.37,56.01 4.64,56.01 5.91,54.74 5.91,29.02 6.54,28.38 6.54,21.08 6.16,20.7 IC5.1
N$45
  Bottom 0.254: R11.2 22.41,42.36 22.41,40.13 | 22.41,40.13 21.53,39.24 R1.2 | R2.2 23.3,39.24 22.41,40.13
N$46
  Bottom 0.254: R12.2 25.65,41.78 | 25.65,41.78 R11.1 | R3.2 25.65,41.78
N$47
  Top 0.254: U$1.LS 27.05,73.66 R53.1
N$49
  Top 0.406: S2.4 S2.1 8.13,74.04 7.24,73.03 6.48,73.03 2.9,69.57 2.9,57.81 3.75,56.96 4.95,56.96 6.82,55.09 6.82,30.26 D1.C 9.02,21.78 12.57,18.22 C4.+
N$50
  Bottom 0.254: R13.2 29.46,41.78 | 29.46,41.78 R12.1 | R4.2 29.46,41.78
N$51
  Bottom 0.254: R14.2 33.27,41.78 | 33.27,41.78 R13.1 | R5.2 33.27,41.78
N$52
  Bottom 0.254: R15.2 37.08,41.78 | 37.08,41.78 R14.1 | R6.2 37.08,41.78
N$53
  Bottom 0.254: R16.2 40.89,41.78 | 40.89,41.78 R15.1 | R7.2 40.89,41.78
N$54
  Bottom 0.254: R8.2 44.7,41.78 | 44.7,41.78 R16.1 | R17.2 44.7,41.78
N$55
  Bottom 0.254: R18.2 48.51,41.78 | 48.51,41.78 R17.1 | R9.2 48.51,41.78
N$57
  Top 0.254: T1.E 53.34,25.72 49.72,29.34 48.45,29.34 48.01,29.78 R19.1
  Bottom 0.254: T2.B 40.51,29.57 40.51,30.71 42.57,32.77 45.97,32.77 R19.1
N$58
  Top 0.406: LED1.A 15.11,30.61 R21.1
N$59
  Bottom 0.254: DF1.P 6.86,67.44 7.18,67.12 12.51,67.12 R22.2
N$60
  Bottom 0.254: DF0.P 6.86,62.36 7.18,62.04 12.64,62.04 R23.2
N$61
  Bottom 0.254: CL.P 6.86,57.28 7.18,56.96 12.51,56.96 R24.2
N$62
  Top 0.254: 27.48,27.96 27.48,21.34 26.8,20.65 26.11,20.65 24.97,21.79 24.05,21.79 R34.2 | 27.48,27.96 28.85,29.34 R29.2 | 27.48,27.96 26.34,27.96 24.97,29.34 24.05,29.34 R28.2
N$63
  Top 0.254: 29.08,22.02 R35.2 28.85,22.02 28.85,22.94 27.94,23.85 27.94,26.37 30.45,28.88 | 30.45,28.88 30.45,29.57 29.54,30.48 23.37,30.48 22.68,29.79 22.68,25.45 21.54,24.31 21.54,22.02 R34.1 | 30.45,28.88 30.91,28.42 32.97,28.42 33.88,29.34 R30.2
N$64
  Top 0.254: 34.11,22.02 R36.2 33.88,21.79 32.97,21.79 30.23,19.05 25.88,19.05 24.97,18.14 24.97,17.68 24.28,16.99 23.37,16.99 22.68,17.68 22.68,22.48 24.28,24.08 | 24.28,24.08 26.34,22.02 R35.1 | 24.28,24.08 24.05,24.31 24.05,25.45 R31.2
N$65
  Top 0.254: 31.14,21.57 31.37,21.79 R36.1 31.14,21.57 | 31.14,21.57 29.77,20.19 26.11,20.19 24.05,18.14 R37.2 | 31.14,21.57 30.91,21.57 28.63,23.85 28.63,24.77 28.85,24.99 28.85,25.45 R32.2
N$66
  Bottom 0.254: RESET.1 11.84,35.33 R25.1
N$67
  Top 0.254: T4.B 40.51,21.11 42.11,19.51 43.48,19.51 46.91,22.94 47.83,22.94 R40.1 48.06,22.94 51.26,19.74 T3.E
RST
  Top 0.254: RESET.3 14.76,39.85 15.49,39.12 15.49,35.31 17.22,33.58 17.22,16.12 23.05,10.29 48.13,10.29 48.45,10.6 56.71,10.6 60.83,6.48 63.05,6.48 64.64,8.06 64.64,12.83 64.33,13.14 62.04,13.14 JP5.25
SL  (via drill 0.61)
  Top 0.254: v95.21,17.35 94.58,21.87 94.07,25.55 94.14,29.05 94.84,32.47 v94.49,42.67
  Bottom 0.254: v95.21,17.35 86.25,17.59 78.61,16.32 76.63,12.42 76.63,8.85 75.31,7.53 75.31,5.46 JP4.5 | SL.1 14.22,49.81 | 14.22,49.81 R26.1 | 14.22,49.81 16.18,47.85 50.57,47.85 52.9,45.53 52.9,42.67 54.8,40.77 58.29,40.77 58.29,46.8 65.91,46.8 68.45,45.85 76.39,45.85 85.95,42.95 v94.49,42.67
ST
  Top 0.254: JP4.7 75.06,2.67 69.09,2.67 68.77,2.35 68.83,2.35 68.16,1.68 42.29,1.68 40.66,3.3 36.07,3.3 34.75,1.98 18.66,1.98 16.66,3.98 16.66,33.19 11.94,37.91 8.45,37.91 7.81,38.54 7.81,41.72 8.53,42.44 ST.1
  Bottom 0.254: ST.1 11.96,42.44 R27.1
VIDEO
  Top 0.254: X1.5 29.08,67.44 29.4,67.75 29.4,73.47 R53.2

### Text on the board
Bottom: STELLABLUE REV 0.3
tDocu: GND